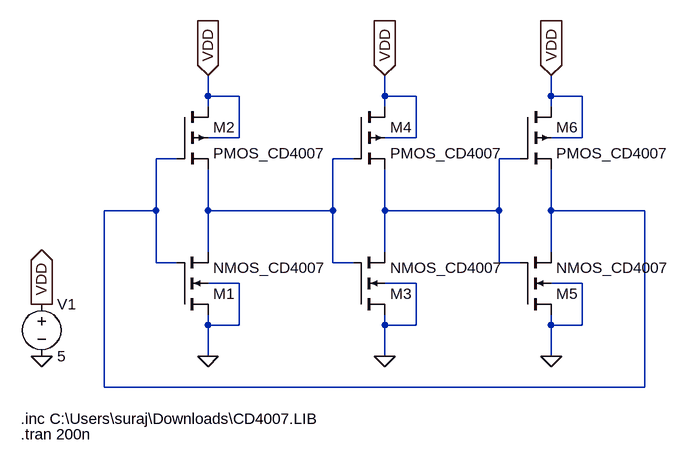
[diagram p0: schematic Ring_Osci_3.asc]
Ring_Osci_3.asc, the LTspice schematic file:
Version 4
SHEET 1 880 680
WIRE 112 -64 112 -96
WIRE 160 -64 112 -64
WIRE 384 -64 384 -96
WIRE 432 -64 384 -64
WIRE 640 -64 640 -96
WIRE 688 -64 640 -64
WIRE 112 -48 112 -64
WIRE 384 -48 384 -64
WIRE 640 -48 640 -64
WIRE 160 0 160 -64
WIRE 160 0 112 0
WIRE 432 0 432 -64
WIRE 432 0 384 0
WIRE 688 0 688 -64
WIRE 688 0 640 0
WIRE 64 32 32 32
WIRE 336 32 304 32
WIRE 592 32 560 32
WIRE 32 112 32 32
WIRE 32 112 -48 112
WIRE 112 112 112 48
WIRE 304 112 304 32
WIRE 304 112 112 112
WIRE 384 112 384 48
WIRE 560 112 560 32
WIRE 560 112 384 112
WIRE 640 112 640 48
WIRE 784 112 640 112
WIRE 112 176 112 112
WIRE 384 176 384 112
WIRE 640 176 640 112
WIRE 32 192 32 112
WIRE 64 192 32 192
WIRE 304 192 304 112
WIRE 336 192 304 192
WIRE 560 192 560 112
WIRE 592 192 560 192
WIRE 160 224 112 224
WIRE 432 224 384 224
WIRE 688 224 640 224
WIRE 112 288 112 272
WIRE 160 288 160 224
WIRE 160 288 112 288
WIRE 384 288 384 272
WIRE 432 288 432 224
WIRE 432 288 384 288
WIRE 640 288 640 272
WIRE 688 288 688 224
WIRE 688 288 640 288
WIRE 112 336 112 288
WIRE 384 336 384 288
WIRE 640 336 640 288
WIRE -48 384 -48 112
WIRE 784 384 784 112
WIRE 784 384 -48 384
FLAG 112 336 0
FLAG 112 -96 VDD
IOPIN 112 -96 In
FLAG -144 256 VDD
IOPIN -144 256 Out
FLAG -144 336 0
FLAG 384 336 0
FLAG 384 -96 VDD
IOPIN 384 -96 In
FLAG 640 336 0
FLAG 640 -96 VDD
IOPIN 640 -96 In
SYMBOL nmos4 64 272 M180
SYMATTR InstName M1
SYMATTR Value NMOS_CD4007
SYMATTR Value2 l=5u w=170u
SYMBOL pmos4 64 -48 R0
SYMATTR InstName M2
SYMATTR Value PMOS_CD4007
SYMATTR Value2 l=5u w=360u
SYMBOL voltage -144 240 R0
WINDOW 123 0 0 Left 0
WINDOW 39 0 0 Left 0
SYMATTR InstName V1
SYMATTR Value 5
SYMBOL nmos4 336 272 M180
SYMATTR InstName M3
SYMATTR Value NMOS_CD4007
SYMATTR Value2 l=5u w=170u
SYMBOL pmos4 336 -48 R0
SYMATTR InstName M4
SYMATTR Value PMOS_CD4007
SYMATTR Value2 l=5u w=360u
SYMBOL nmos4 592 272 M180
SYMATTR InstName M5
SYMATTR Value NMOS_CD4007
SYMATTR Value2 l=5u w=170u
SYMBOL pmos4 592 -48 R0
SYMATTR InstName M6
SYMATTR Value PMOS_CD4007
SYMATTR Value2 l=5u w=360u
TEXT -176 432 Left 2 !.inc C:\\Users\\suraj\\Downloads\\CD4007.LIB
TEXT -176 456 Left 2 !.tran 200n

The netlist it stands for:
* Ring_Osci_3.asc
M1 0 N001 N002 0 NMOS_CD4007 l=5u w=170u
M2 VDD N001 N002 VDD PMOS_CD4007 l=5u w=360u
V1 VDD 0 5
M3 0 N002 N003 0 NMOS_CD4007 l=5u w=170u
M4 VDD N002 N003 VDD PMOS_CD4007 l=5u w=360u
M5 0 N003 N001 0 NMOS_CD4007 l=5u w=170u
M6 VDD N003 N001 VDD PMOS_CD4007 l=5u w=360u
.model NMOS NMOS
.model PMOS PMOS
.lib standard.mos
.inc C:\Users\suraj\Downloads\CD4007.LIB
.tran 200n
.backanno
.end